# Altium project Mini_AHRS.PrjPcb
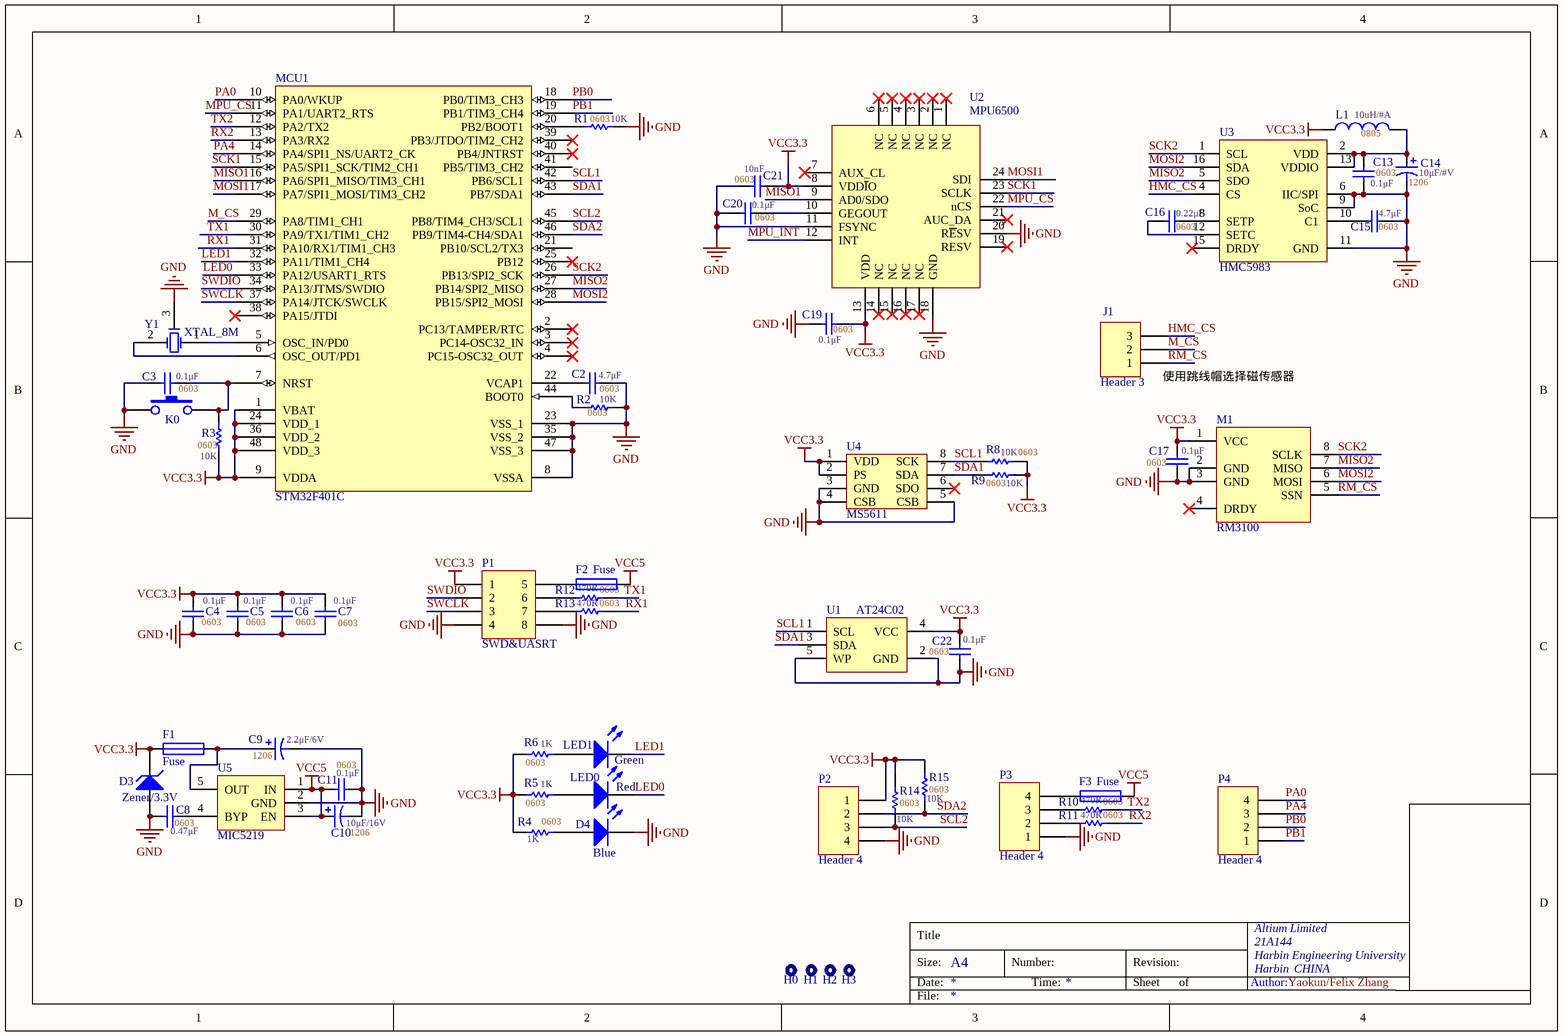
[diagram p0: Mini_AHRS.SchDoc]
1 sheet, 59 parts. Net scope: global (net labels, ports and power ports of the same name join across sheets).
Board file: Mini_AHRS_TEST.PcbDoc

## Sheet Mini_AHRS.SchDoc
size A4; Author: Yaokun/Felix Zhang; Organization: Altium Limited; Address1: 21A144; Address2: Harbin Engineering University; Address3: Harbin; Address4: CHINA

### Parts
C2  value 4.7μF  [CAP_0603_16*08]  (hidden comment: 0603)
C3  value 0.1μF  [CAP_0603_16*08]  (hidden comment: 0603)
C4  value 0.1μF  [CAP_0603_16*08]  (hidden comment: 0603)
C5  value 0.1μF  [CAP_0603_16*08]  (hidden comment: 0603)
C6  value 0.1μF  [CAP_0603_16*08]  (hidden comment: 0603)
C7  value 0.1μF  [CAP_0603_16*08]  (hidden comment: 0603)
C8  value 0.47μF  [CAP_0603_16*08]  (hidden comment: 0603)
C9  value 2.2μF/6V  PackageReference: 1206  [CAP_0805_20*12]  (hidden comment: Polar)
C10  value 10μF/16V  PackageReference: 1206  [CAP_1206]  (hidden comment: Polar)
C11  value 0.1μF  [CAP_0603_16*08]  (hidden comment: 0603)
C13  value 0.1μF  [CAP_0603_16*08]  (hidden comment: 0603)
C14  value 10μF/#V  PackageReference: 1206  [CAP_0805_20*12]  (hidden comment: Polar)
C15  value 4.7μF  [CAP_0805_20*12]  (hidden comment: 0603)
C16  value 0.22μF  [CAP_0603_16*08]  (hidden comment: 0603)
C17  value 0.1μF  [CAP_0603_16*08]  (hidden comment: 0603)
C19  value 0.1μF  [CAP_0603_16*08]  (hidden comment: 0603)
C20  value 0.1μF  [CAP_0603_16*08]  (hidden comment: 0603)
C21  value 10nF  [CAP_0603_16*08]  (hidden comment: 0603)
C22  value 0.1μF  [CAP_0603_16*08]  (hidden comment: 0603)
D3  Zener/3.3V  [SOD523]
D4  Blue  [CAP_0603_16*08]
F1  Fuse  [RES_0805_20*12]
F2  Fuse  [RES_0805_20*12]
F3  Fuse  [RES_0805_20*12]
H0  Pad-SCREW  [PAD_M2]  (value not drawn)
H1  Pad-SCREW  [PAD_M2]  (value not drawn)
H2  Pad-SCREW  [PAD_M2]  (value not drawn)
H3  Pad-SCREW  [PAD_M2]  (value not drawn)
J1  Header 3  [HEADER1*3sig]
K0  KEY  [KEY_2]  (value not drawn)
L1  value 10uH/#A  PackageReference: 0805  [IND_0805_20*12]  (hidden comment: MODEL?)
LED0  Red  [CAP_0603_16*08]
LED1  Green  [CAP_0603_16*08]
M1  RM3100  [RM3100_MODEUL]
MCU1  STM32F401C  [QFN-48_7x7x05P]
P1  SWD&UASRT  [HEADER2*4_PIN]
P2  Header 4  [JST_CH1.0_4P]
P3  Header 4  [JST_CH1.0_4P]
P4  Header 4  [HEADER1*4_PIN]
R1  value 10K  PackageReference: 0603  [RES_0603_16*08]  (hidden comment: SMD)
R2  value 10K  PackageReference: 0603  [RES_0603_16*08]  (hidden comment: SMD)
R3  value 10K  PackageReference: 0603  [RES_0603_16*08]  (hidden comment: SMD)
R4  value 1K  PackageReference: 0603  [RES_0603_16*08]  (hidden comment: SMD)
R5  value 1K  PackageReference: 0603  [RES_0603_16*08]  (hidden comment: SMD)
R6  value 1K  PackageReference: 0603  [RES_0603_16*08]  (hidden comment: SMD)
R8  value 10K  PackageReference: 0603  [RES_0603_16*08]  (hidden comment: SMD)
R9  value 10K  PackageReference: 0603  [RES_0603_16*08]  (hidden comment: SMD)
R10  value 470R  PackageReference: 0603  [RES_0603_16*08]  (hidden comment: SMD)
R11  value 470R  PackageReference: 0603  [RES_0603_16*08]  (hidden comment: SMD)
R12  value 470R  PackageReference: 0603  [RES_0603_16*08]  (hidden comment: SMD)
R13  value 470R  PackageReference: 0603  [RES_0603_16*08]  (hidden comment: SMD)
R14  value 10K  PackageReference: 0603  [RES_0603_16*08]  (hidden comment: SMD)
R15  value 10K  PackageReference: 0603  [RES_0603_16*08]  (hidden comment: SMD)
U1  AT24C02  [SOT23-5]
U2  MPU6500  [QFN24_3*3*0.4]
U3  HMC5983  [QFN-16_3x3x05P]
U4  MS5611  [MS5611]
U5  MIC5219  [SOT23-5]
Y1  XTAL_8M  [XTAL_SMD_8M]

### Nets
GND: C2.1 C3.1 C4.2 C5.2 C6.2 C7.1 C8.2 C9.2 C10.2 C11.1 C13.2 C14.2 C15.1 C17.2 C19.2 C20.2 C21.2 C22.2 D3.1(A) D4.2(K) K0.1 M1.2(GND) M1.3(GND) MCU1.8(VSSA) MCU1.23(VSS_1) MCU1.35(VSS_2) MCU1.47(VSS_3) P1.4 P1.8 P2.4 P3.1 R1.2 R2.1 U1.2(GND) U1.5(WP) U2.11(FSYNC) U2.18(GND) U2.20(R~{E}SV) U3.6(IIC/SPI) U3.9(SoC) U3.11(GND) U4.3(GND) U4.4(CSB) U4.5(CSB) U5.2(GND) Y1.3(OSC3)
VCC3.3: C4.1 C5.1 C6.1 C7.2 C17.1 C19.1 C21.1 C22.1 D3.2(K) F1.1 L1.1 M1.1(VCC) MCU1.1(VBAT) MCU1.9(VDDA) MCU1.24(VDD_1) MCU1.36(VDD_2) MCU1.48(VDD_3) P1.1 P2.1 R3.2 R4.1 R5.1 R6.1 R8.2 R9.2 R14.1 R15.1 U1.4(VCC) U2.8(VDD~{I}O) U2.13(VDD) U4.1(VDD) U4.2(PS)
VCC5: C10.1 C11.2 F2.2 F3.2 U5.1(IN) U5.3(EN)
HMC_CS: J1.3 U3.4(CS)
LED0: LED0.2(K) MCU1.33(PA12/USART1_RTS)
LED1: LED1.2(K) MCU1.32(PA11/TIM1_CH4)
M_CS: J1.2 MCU1.29(PA8/TIM1_CH1)
MISO1: MCU1.16(PA6/SPI1_MISO/TIM3_CH1) U2.9(AD0/SDO)
MISO2: M1.7(MISO) MCU1.27(PB14/SPI2_MISO) U3.5(SDO)
MOSI1: MCU1.17(PA7/SPI1_MOSI/TIM3_CH2) U2.24(SDI)
MOSI2: M1.6(MOSI) MCU1.28(PB15/SPI2_MOSI) U3.16(SDA)
MPU_CS: MCU1.11(PA1/UART2_RTS) U2.22(nCS)
MPU_INT: U2.12(INT)
PA0: MCU1.10(PA0/WKUP) P4.4
PA4: MCU1.14(PA4/SPI1_NS/UART2_CK) P4.3
PB0: MCU1.18(PB0/TIM3_CH3) P4.2
PB1: MCU1.19(PB1/TIM3_CH4) P4.1
RM_CS: J1.1 M1.5(SSN)
RX1: MCU1.31(PA10/RX1/TIM1_CH3) R13.1
RX2: MCU1.13(PA3/RX2) R11.1
SCK1: MCU1.15(PA5/SPI1_SCK/TIM2_CH1) U2.23(SCLK)
SCK2: M1.8(SCLK) MCU1.26(PB13/SPI2_SCK) U3.1(SCL)
SCL1: MCU1.42(PB6/SCL1) R8.1 U1.1(SCL) U4.8(SCK)
SCL2: MCU1.45(PB8/TIM4_CH3/SCL1) P2.3 R14.2
SDA1: MCU1.43(PB7/SDA1) R9.1 U1.3(SDA) U4.7(SDA)
SDA2: MCU1.46(PB9/TIM4-CH4/SDA1) P2.2 R15.2
SWCLK: MCU1.37(PA14/JTCK/SWCLK) P1.3
SWDIO: MCU1.34(PA13/JTMS/SWDIO) P1.2
TX1: MCU1.30(PA9/TX1/TIM1_CH2) R12.1
TX2: MCU1.12(PA2/TX2) R10.1
NetC2_2: C2.2 MCU1.22(VCAP1)
NetC3_2: C3.2 K0.2 MCU1.7(NRST) R3.1
NetC8_1: C8.1 U5.4(BYP)
NetC9_1: C9.1 F1.2 U5.5(OUT)
NetC13_1: C13.1 C14.1 L1.2 U3.2(VDD) U3.13(VDDIO)
NetC15_2: C15.2 U3.10(C1)
NetC16_1: C16.1 U3.8(SETP)
NetC16_2: C16.2 U3.12(SETC)
NetC20_1: C20.1 U2.10(GEGOUT)
NetD4_1: D4.1(A) R4.2
NetF2_1: F2.1 P1.5
NetF3_1: F3.1 P3.4
NetLED0_1: LED0.1(A) R5.2
NetLED1_1: LED1.1(A) R6.2
NetMCU1_5: MCU1.5(OSC_IN/PD0) Y1.1(OSC1)
NetMCU1_6: MCU1.6(OSC_OUT/PD1) Y1.2(OSC2)
NetMCU1_20: MCU1.20(PB2/BOOT1) R1.1
NetMCU1_44: MCU1.44(BOOT0) R2.2
NetP1_6: P1.6 R12.2
NetP1_7: P1.7 R13.2
NetP3_2: P3.2 R11.2
NetP3_3: P3.3 R10.2

Not connected (* = marked no-connect by the designer): M1 4(DRDY)*; MCU1 2(PC13/TAMPER/RTC)* 3(PC14-OSC32_IN)* 4(PC15-OSC32_OUT)* 21(PB10/SCL2/TX3) 25(PB12)* 38(PA15/JTDI)* 39(PB3/JTDO/TIM2_CH2)* 40(PB4/JNTRST)* 41(PB5/TIM3_CH2); U2 1(NC)* 2(NC)* 3(NC)* 4(NC)* 5(NC)* 6(NC)* 7(AUX_CL)* 14(NC)* 15(NC)* 16(NC)* 17(NC)* 19(RESV)* 21(AUC_DA)*; U3 15(DRDY)*; U4 6(SDO)*

### Notes on the sheet
- (near J1) 使用跳线帽选择磁传感器
- Title
- Size:
- Date:
- A4
- Number:
- Time:
- Revision:
- Sheet
- of
- Author:
- File:

### Library data of the parts
C2-C8 C11 C13 C15-C17 C19-C22 = Cap: Capacitor; Published: 8-Jun-2000; LatestRevisionDate: 17-Jul-2002; LatestRevisionNote: Re-released for DXP Platform.; Publisher: Altium Limited; PackageDescription: 0603; PackageReference: 0603
C9 C10 C14 = Cap Pol: Polarized Capacitor (Axial); LatestRevisionDate: 17-Jul-2002; LatestRevisionNote: Re-released for DXP Platform.; Publisher: Altium Limited; Published: 1206; PackageDescription: Polar
D3 = D Zener: Zener Diode; Published: 8-Jun-2000; LatestRevisionDate: 17-Jul-2002; LatestRevisionNote: Re-released for DXP Platform.; PackageReference: DIODE-0.7; Publisher: Altium Limited; PackageDescription: Diode, Thru-Hole; 2 Leads; 0.7 in Pin Spacing
D4 LED0 LED1 = LED: Typical RED, GREEN, YELLOW, AMBER GaAs LED; Published: 8-Jun-2000; LatestRevisionDate: 17-Jul-2002; LatestRevisionNote: Re-released for DXP Platform.; PackageVersion: Feb-2002; PackageReference: 3.2X1.6X1.1; Publisher: Altium Limited; PackageDescription: SM LED; 2 Flat Leads
F1-F3 = Fuse 1: Published: 8-Jun-2000; LatestRevisionDate: 17-Jul-2002; LatestRevisionNote: Re-released for DXP Platform.; PackageReference: PIN-W2/E2.8; Publisher: Altium Limited; PackageDescription: Thru-Hole; 2 Leads
J1 = Header 3: Header, 3-Pin; LatestRevisionDate: 17-Jul-2002; LatestRevisionNote: Re-released for DXP Platform.; Publisher: Altium Limited
L1 = Inductor: Code_IEC: 1005; Published: 8-Jun-2000; LatestRevisionDate: 29-May-2009; LatestRevisionNote: IPC-7351 Footprint Added.; Publisher: Altium Limited; Code_JEITA: 0402; PackageDescription: Power
M1 = RM3100_MODEUL
MCU1 = STM32F401C*U6
P1 = Header 4X2: Header, 4-Pin, Dual row; LatestRevisionDate: 17-Jul-2002; LatestRevisionNote: Re-released for DXP Platform.; Publisher: Altium Limited
P2-P4 = Header 4: Header, 4-Pin; LatestRevisionDate: 17-Jul-2002; LatestRevisionNote: Re-released for DXP Platform.; Publisher: Altium Limited
R1-R6 R8-R15 = RES_SMD: Resistor; Published: 8-Jun-2000; LatestRevisionDate: 17-Jul-2002; LatestRevisionNote: Re-released for DXP Platform.; Publisher: Altium Limited; PackageDescription: SMD
U1 = AT24C02-5Pin